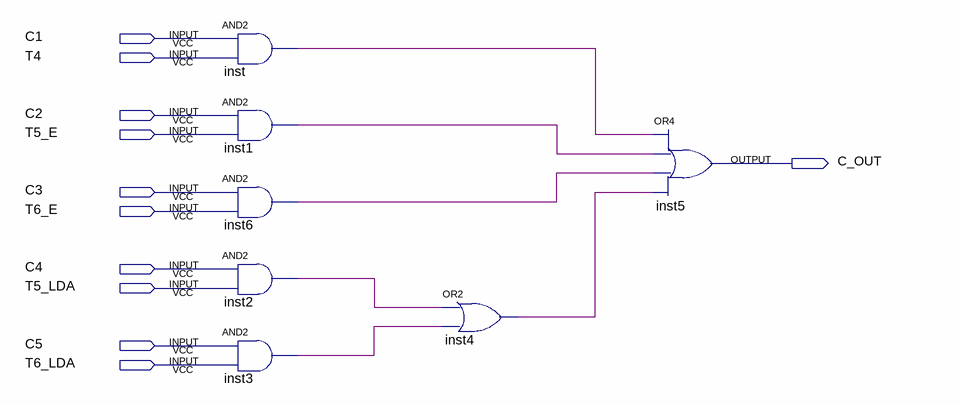
[diagram p0: schematic sheet]
// Quartus schematic Multiplexador.bdf as structural Verilog: 7 symbols, 11 pins
module Multiplexador (
  input  C1,
  input  T4,
  input  C2,
  input  T5_E,
  input  C3,
  input  T6_E,
  input  C4,
  input  T5_LDA,
  input  C5,
  input  T6_LDA,
  output C_OUT
);

  wire inst1_out, inst2_out, inst3_out, inst4_out, inst6_out, inst_out;

  and inst (inst_out, C1, T4);
  and inst1 (inst1_out, C2, T5_E);
  and inst6 (inst6_out, C3, T6_E);
  and inst2 (inst2_out, C4, T5_LDA);
  and inst3 (inst3_out, C5, T6_LDA);
  or inst4 (inst4_out, inst2_out, inst3_out);
  or inst5 (C_OUT, inst_out, inst1_out, inst6_out, inst4_out);
endmodule
